# EAGLE design kitt_0805 (EAGLE 7.6.0)
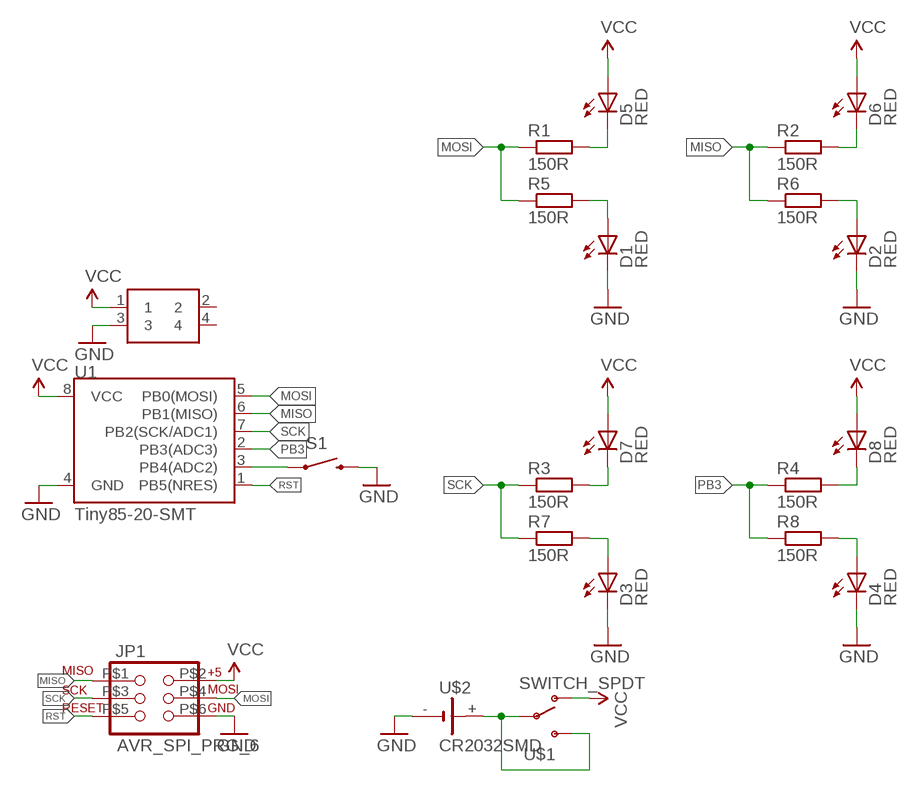
[diagram p0: schematic, sheet 1]

## Parts
D1  RED  LEDCHIP-LED0805  [CHIP-LED0805]
D2  RED  LEDCHIP-LED0805  [CHIP-LED0805]
D3  RED  LEDCHIP-LED0805  [CHIP-LED0805]
D4  RED  LEDCHIP-LED0805  [CHIP-LED0805]
D5  RED  LEDCHIP-LED0805  [CHIP-LED0805]
D6  RED  LEDCHIP-LED0805  [CHIP-LED0805]
D7  RED  LEDCHIP-LED0805  [CHIP-LED0805]
D8  RED  LEDCHIP-LED0805  [CHIP-LED0805]
JP1  AVR_SPI_PRG_6  [2X3_SMD_PAD]
R1  150R  R-EU_M0805  [M0805]
R2  150R  R-EU_M0805  [M0805]
R3  150R  R-EU_M0805  [M0805]
R4  150R  R-EU_M0805  [M0805]
R5  150R  R-EU_M0805  [M0805]
R6  150R  R-EU_M0805  [M0805]
R7  150R  R-EU_M0805  [M0805]
R8  150R  R-EU_M0805  [M0805]
S1  SWITCH-MOMENTARY-2-SMD-1101NE  [TACTILE-SWITCH-1101NE]
U1  Tiny85-20-SMT  ATTINY45TINY85-20-SMT  [SO08-EIAJ]
U$1  SWITCH_SPDT  [KPS-1290]
U$2  CR2032SMD  [CR2032SMD]
U$4  2X2-SMT  [2X2-SMT]

## Nets
GND: D1.C D2.C D3.C D4.C JP1.P$6 S1.P$2 U1.4(GND) U$2.- U$4.3
MISO: JP1.P$1 R2.1 R6.1 U1.6(PB1(MISO))
MOSI: JP1.P$4 R1.1 R5.1 U1.5(PB0(MOSI))
N$1: S1.P$1 U1.3(PB4(ADC2))
N$2: D5.C R1.2
N$3: D1.A R5.2
N$4: D3.A R7.2
N$5: U$1.P U$1.S U$2.+
N$9: D4.A R8.2
N$10: D2.A R6.2
N$11: D6.C R2.2
N$13: D7.C R3.2
N$14: D8.C R4.2
PB3: R4.1 R8.1 U1.2(PB3(ADC3))
RST: JP1.P$5 U1.1(PB5(NRES))
SCK: JP1.P$3 R3.1 R7.1 U1.7(PB2(SCK/ADC1))
VCC: D5.A D6.A D7.A D8.A JP1.P$2 U1.8(VCC) U$1.O U$4.1
Unconnected: U$4.2 U$4.4

## Library data of the parts
D1-D8 = led:LED: LED OSRAM: - CHIPLED LG R971, LG N971, LY N971, LG Q971, LY Q971, LO R971, LY R971 LH N974, LH R974 LS Q976, LO Q976, LY Q976 LO Q996 - Hyper CHIPLED LW Q18S LB Q993, LB Q99A, LB R99A - SideLED LS A670, LO A670, LY A670, LG A670, LP A670 LB A673, LV A673, LT A673, LW A673 LH A674 LY A675 LS A676, LA A676, LO A676, LY A676, LW A676 LS A679, LY A679, LG A679 - Hyper Micro SIDELED® LS Y876, LA Y876, LO Y876, LY Y876 LT Y87S - SmartLED LW L88C, LW L88S LB L89C, LB L89S, LG L890 LS L89K, LO L89K, LY L89K LS L896, LA L896, LO L896, LY L896 - TOPLED LS T670, LO T670, LY T670, LG T670, LP T670 LSG T670, LSP T670, LSY T670, LOP T670, LYG T670 LG T671, LOG T671, LSG T671 LB T673, LV T673, LT T673, LW T673 LH T674 LS T676, LA T676, LO T676, LY T676, LB T676, LH T676, LSB T676, LW T676 LB T67C, LV T67C, LT T67C, LS T67K, LO T67K, LY T67K, LW E67C LS E67B, LA E67B, LO E67B, LY E67B, LB E67C, LV E67C, LT E67C LW T67C LS T679, LY T679, LG T679 LS T770, LO T770, LY T770, LG T770, LP T770 LB T773, LV T773, LT T773, LW T773 LH T774 LS E675, LA E675, LY E675, LS T675 LS T776, LA T776, LO T776, LY T776, LB T776 LHGB T686 LT T68C, LB T68C - Hyper Mini TOPLED® LB M676 - Mini TOPLED Santana® LG M470 LS M47K, LO M47K, LY M47K Source: http://www.osram.convergy.de LUXEON: - LUMILED® LXK2-PW12-R00, LXK2-PW12-S00, LXK2-PW14-U00, LXK2-PW14-V00 LXK2-PM12-R00, LXK2-PM12-S00, LXK2-PM14-U00 LXK2-PE12-Q00, LXK2-PE12-R00, LXK2-PE12-S00, LXK2-PE14-T00, LXK2-PE14-U00 LXK2-PB12-K00, LXK2-PB12-L00, LXK2-PB12-M00, LXK2-PB14-N00, LXK2-PB14-P00, LXK2-PB14-Q00 LXK2-PR12-L00, LXK2-PR12-M00, LXK2-PR14-Q00, LXK2-PR14-R00 LXK2-PD12-Q00, LXK2-PD12-R00, LXK2-PD12-S00 LXK2-PH12-R00, LXK2-PH12-S00 LXK2-PL12-P00, LXK2-PL12-Q00, LXK2-PL12-R00 Source: www.luxeon.com KINGBRIGHT: KA-3528ASYC Source: www.kingbright.com
JP1 = SparkFun-Connectors:AVR_SPI_PRG_6: AVR ISP 6 Pin This is the reduced ISP connector for AVR programming. Common on Arduino. This footprint will take up less PCB space and can be used with a 10-pin to 6-pin adapter such as SKU: BOB-08508 **Special note about "TEST_POINT" package. The stop mask is on the top side, so if you want your programming test points to be on the bottom of your board, make sure to place this package on the bottom side of the board. This also ensure that the orientation to program from the bottom side will be correct.
R1-R8 = rcl:R-EU_: RESISTOR, European symbol
S1 = SparkFun-Electromechanical:SWITCH-MOMENTARY-2: Various NO switches- pushbuttons, reed, etc
U1 = SparkFun-DigitalIC:ATTINY45: Atmel 8-pin 2/4/8kB flash uC; PROD_ID: IC-09092
U$1 = SparkFun-Electromechanical:SWITCH_SPDT: SWCH-10651 Side-actuated SPDT slide switch, as used on the Arduino Pro; PROD_ID: SWCH-10651
U$2 = battery:CR2032SMD
U$4 = adafruit:2X2-SMT

## Board
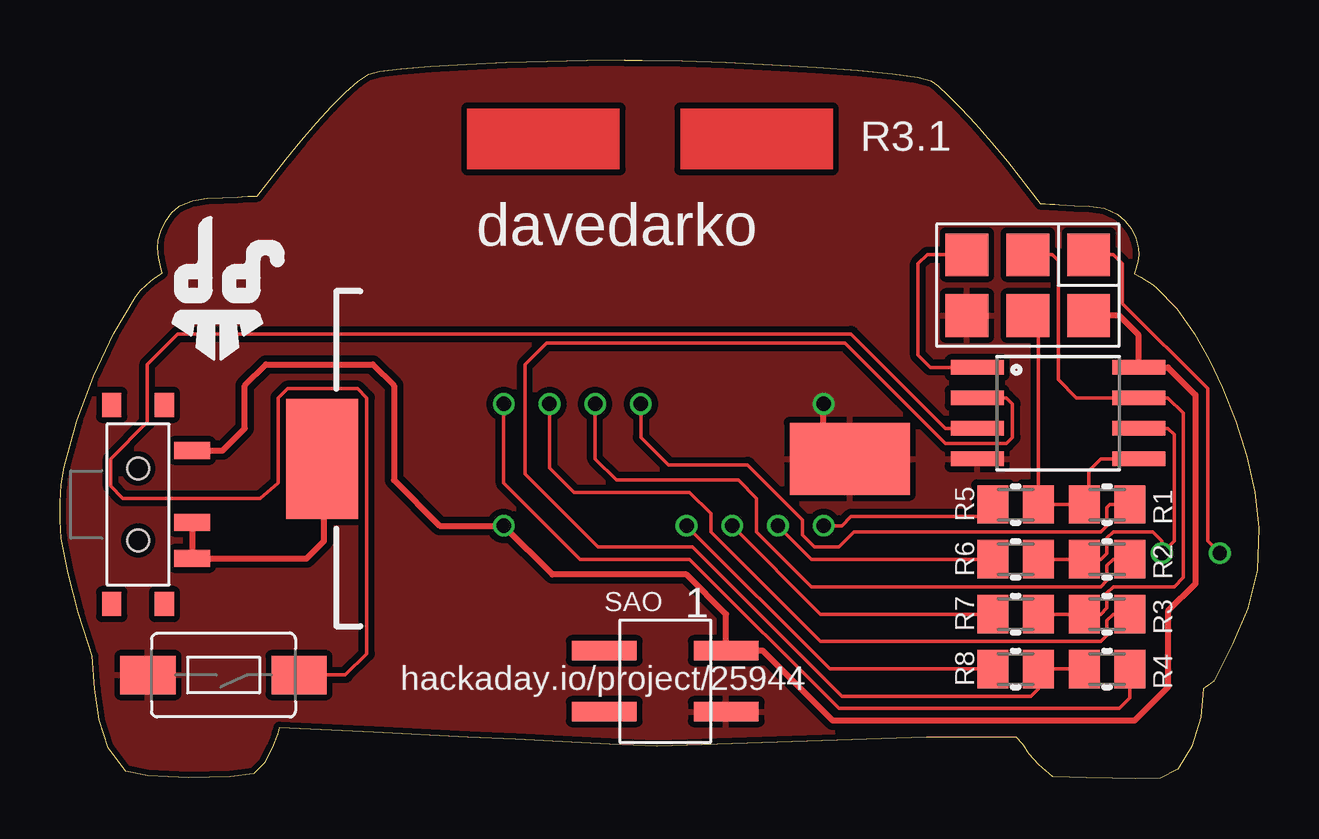
[diagram p1: board, top side]
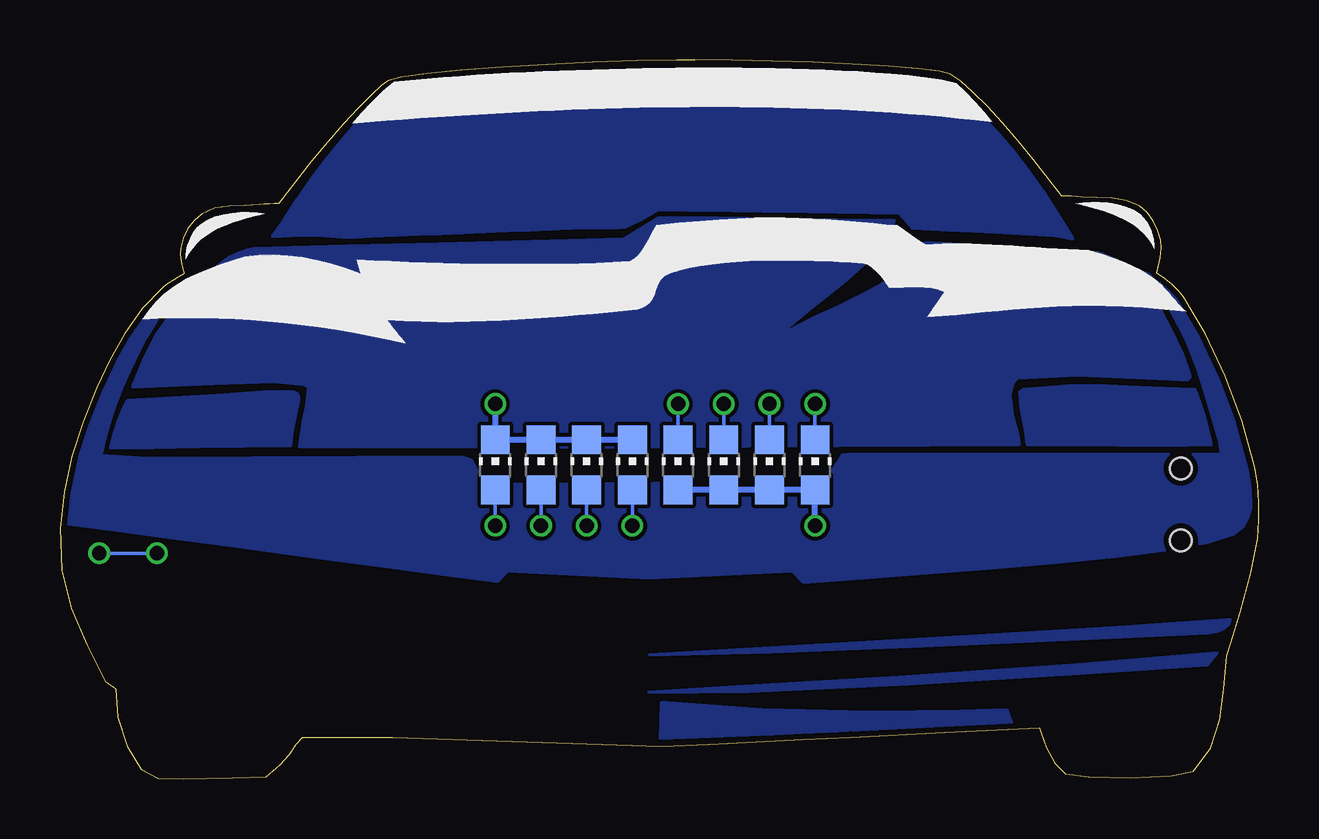
[diagram p2: board, bottom side, seen from below]

Size 49.98 x 29.96 mm. Coordinates in mm from the lower left corner, seen from the top.
Outline: 23.54,29.96 23.63,29.96 23.73,29.96 23.82,29.96 23.92,29.96 24.01,29.96 24.1,29.96 24.2,29.96 24.29,29.96 25.93,29.93 27.76,29.86 29.67,29.77 31.54,29.66 33.25,29.54 34.69,29.4 35.75,29.25 36.31,29.1 36.59,28.89 37.01,28.5 37.54,27.96 38.16,27.3 38.82,26.54 39.52,25.72 40.87,23.97 41.06,23.96 41.26,23.95 41.47,23.94 41.64,23.93 42.27,23.89 42.91,23.87 43.52,23.78 44.08,23.54 44.39,23.26 44.65,22.92 44.83,22.53 44.95,22.13 44.96,21.86 44.92,21.55 44.85,21.26 44.79,21.05 45.04,20.91 45.28,20.77 45.49,20.63 45.68,20.49 46.55,19.59 47.28,18.56 47.9,17.45 48.44,16.31 49.02,14.9 49.48,13.44 49.81,11.95 49.98,10.44 49.9,8.68 49.5,7.11 48.87,5.6 48.08,4.05 47.98,3.97 47.87,3.89 47.76,3.82 47.65,3.74 47.56,2.56 47.18,1.35 46.59,0.4 45.87,0.01 44.81,0 43.86,0.01 42.78,0.04 41.38,0.08 40.79,0.57 40.41,1.01 40.13,1.44 39.86,1.73 36.12,1.73 34.25,1.66 32.38,1.6 30.51,1.53 28.64,1.47 26.77,1.4 24.9,1.34 22.93,1.44 20.96,1.53 18.99,1.63 17.02,1.73 13.08,1.93 9.14,2.13 9.07,1.87 8.85,1.29 8.51,0.65 8.07,0.2 7.1,0.07 5.37,0.04 3.65,0.11 2.74,0.3 2.02,1.28 1.64,2.45 1.46,3.75 1.35,5.12 1.17,5.65 0.77,6.94 0.33,8.55 0.06,10.02 0,10.76 0,11.51 0.06,12.25 0.18,12.99 0.7,14.89 1.4,16.79 2.23,18.56 3.15,20.09 3.35,20.35 3.61,20.6 3.92,20.84 4.26,21.08 4.19,21.36 4.12,21.72 4.08,22.11 4.1,22.45 4.22,22.86 4.41,23.24 4.66,23.59 4.98,23.86 5.53,24.1 6.14,24.2 6.78,24.22 7.41,24.25 7.6,24.27 7.81,24.28 8.03,24.29 8.23,24.29 9.4,25.82 10.05,26.59 10.7,27.34 11.33,28.03 11.91,28.61 12.43,29.08 12.86,29.38 13.32,29.49 14.21,29.6 15.45,29.7 16.94,29.79 18.59,29.86 20.29,29.92 21.98,29.95 23.54,29.96
Outline: 23.54,29.96 23.54,29.96
Outline: 23.54,29.96 23.54,29.96
Copper layers (1*16): Top 0.035mm / dielectric 1.5mm / Bottom 0.035mm
Design rules "dirt_cheap_dirty_boards.v1.1": minimum track width 6mil, minimum drill 12mil, track to track 6mil, track to pad 6mil, pad to pad 6mil, via to via 6mil, smd to smd 0mil, copper to edge 10mil, drill to drill 10mil, minimum pad ring 10mil, minimum via ring 6mil, stop-mask expansion 2mil, vias tented up to drill 25mil, thermal gap 10mil

### Footprints (pad centres in the part's own frame; a part is rotated, then mirrored left to right if it is on the bottom)
CHIP-LED0805 = smd 1.2 x 1.2: A 0,-1.05; C 0,1.05
2X3_SMD_PAD = smd 1.778 x 1.778: P$1 -1.27,2.54; P$2 1.27,2.54; P$3 -1.27,0; P$4 1.27,0; P$5 -1.27,-2.54; P$6 1.27,-2.54
M0805 = smd 1.3 x 1.6: 1 -0.95,0; 2 0.95,0
TACTILE-SWITCH-1101NE = smd 2.3 x 1.6: P$1 -3.15,0; P$2 3.15,0
SO08-EIAJ = smd 0.61 x 2.21: 1 -1.905,-3.378; 2 -0.635,-3.378; 3 0.635,-3.378; 4 1.905,-3.378; 5 1.905,3.353; 6 0.635,3.353; 7 -0.635,3.353; 8 -1.905,3.353
KPS-1290 = smd 0.7 x 1.5: O -2.25,2.25; P 0.75,2.25; S 2.25,2.25 | smd 1 x 0.8: P$1 -4.15,1.1; P$2 -4.15,-1.1; P$3 4.15,-1.1; P$4 4.15,1.1 | hole 0.9: -1.5,0; 1.5,0
CR2032SMD = smd 5 x 3: + 0,-11 | smd 3 x 5: - 0,11
2X2-SMT = smd 0.8 x 2.7: 1 0,2.54; 2 0,-2.54; 3 2.54,2.54; 4 2.54,-2.54

### Placement (x,y rotation side)
D1  31.83,13.08 0 bottom
D2  29.93,13.08 0 bottom
D3  28.02,13.08 0 bottom
D4  26.12,13.08 0 bottom
D5  24.21,13.08 0 bottom
D6  22.31,13.08 0 bottom
D7  20.4,13.08 0 bottom
D8  18.5,13.08 0 bottom
JP1  40.34,20.57 270 top
R1  43.64,11.43 0 top
R2  43.64,9.14 0 top
R3  43.64,6.86 0 top
R4  43.64,4.57 0 top
R5  39.83,11.43 180 top
R6  39.83,9.14 180 top
R7  39.83,6.86 180 top
R8  39.83,4.57 180 top
S1  6.81,4.32 180 top
U1  41.61,15.24 270 top
U$1  3.26,11.43 270 top
U$2  21.93,13.33 270 top
U$3  [DAVEDARKO2_LOGO]  6.56,19.68 0 top
U$4  25.23,5.33 270 top

### Tracks (layer width: path | path; a pad name or v marks a point on that pad's centre or on a via)
GND  (via drill 0.6 pad 0.33)
  Top 0.254: U$2.- 31.83,14.43 v31.83,15.62
  Bottom 0.254: D4.C D3.C D2.C D1.C v31.83,15.62
  pour Top (isolate 0.254): 52.53,33.02 -0.81,33.02 -0.81,-2.54 52.53,-2.54
MISO  (via drill 0.6 pad 0.33)
  Top 0.152: R6.1 R2.1 43.39,9.14 43.64,9.4 43.64,10.03 43.9,10.29 45.55,10.29 45.93,9.91 v45.93,9.4 46.44,9.91 46.44,14.35 46.18,14.6 U1.6 | JP1.P$1 43.9,21.84 44.28,21.46 44.28,19.81 47.83,16.26 47.83,9.91 v48.34,9.4
  Bottom 0.152: v48.34,9.4 v45.93,9.4
MOSI
  Top 0.152: U1.5 43.39,13.33 42.88,12.83 42.88,11.62 R1.1 R5.1 40.78,18.86 JP1.P$4
N$1
  Top 0.152: S1.P$1 11.89,4.32 12.78,5.21 12.78,15.87 12.4,16.26 9.48,16.26 9.1,15.87 9.1,12.32 8.34,11.68 2.62,11.68 2.11,12.19 2.11,13.33 3.64,14.86 3.64,17.27 4.91,18.54 32.98,18.54 36.91,14.6 U1.3
N$2  (via drill 0.6 pad 0.33)
  Top 0.152: v24.21,15.62 24.21,14.22 25.36,13.08 28.66,13.08 30.94,10.79 30.94,10.16 31.45,9.65 32.47,9.65 33.1,10.29 43.39,10.29 43.64,10.54 43.64,11.3 43.77,11.43 R1.2
  Bottom 0.152: D5.C v24.21,15.62
N$3  (via drill 0.6 pad 0.33)
  Top 0.152: v31.83,10.54 32.59,10.54 32.98,10.92 38.38,10.92 R5.2
  Bottom 0.152: v31.83,10.54 D1.A
N$4  (via drill 0.6 pad 0.33)
  Top 0.152: R7.2 31.71,6.86 v28.02,10.54
  Bottom 0.152: v28.02,10.54 D3.A
N$5
  Top 0.254: U$2.+ 11,13.26 11,9.91 10.28,9.18 U$1.S U$1.P
N$6
  pour Bottom: 24.9,3.19 24.93,2.43 24.95,1.67 21.28,1.82 17.61,1.97 13.94,2.12 10.27,2.27 10.39,2.57 10.52,2.86 12.41,2.8 16.2,2.77 20.73,2.86
  pour Bottom: 47.16,15.77 43.42,15.98 41.25,16.14 40.24,16.12 40.08,16.03 40.03,15.82 40.15,15.22 40.3,14.52 40.36,13.89 42.27,13.86 44.17,13.84 46.08,13.81 47.86,13.79 47.75,14.31 47.56,14.89 47.31,15.46
  pour Bottom: 41.12,22.6 39.95,22.65 38.95,22.64 37.97,22.56 36.96,22.61 35.98,22.65 35.02,22.69 34.08,22.73 33.16,22.77 32.25,22.8 31.34,22.84 30.45,22.87 29.55,22.91 28.65,22.94 27.75,22.98 26.9,22.95 26.42,22.99 25.73,23.32 25.04,23.73 24.42,23.72 23.79,23.71 23.17,23.7 22.54,23.69 21.92,23.68 21.29,23.68 20.67,23.67 20.04,23.66 19.41,23.65 18.78,23.64 18.09,23.63 17.52,23.62 16.89,23.61 16.2,23.61 15.63,23.6 15,23.59 14.66,23.21 14.45,22.96 12.91,22.88 11.4,22.8 9.92,22.72 8.48,22.64 8.12,22.57 7.75,22.5 8.39,23.54 9.01,24.49 9.61,25.35 10.21,26.14 10.84,26.87 11.49,27.55 12.2,28.2 12.98,28.83 13.42,28.99 14.27,29.12 15.46,29.24 16.94,29.33 17.77,29.37 18.66,29.4 19.58,29.43 20.54,29.45 21.53,29.47 22.54,29.48 23.57,29.48 24.6,29.48 25.63,29.47 26.66,29.46 27.67,29.44 28.66,29.42 29.62,29.39 30.54,29.36 31.42,29.32 32.26,29.27 33.74,29.16 34.93,29.03 35.77,28.87 36.21,28.69 36.95,28.01 37.64,27.3 38.29,26.56 38.91,25.78 39.5,24.98 40.07,24.15 40.63,23.29
  pour Bottom: 9.81,16.23 7.98,16.36 6.34,16.38 4.51,16.29 2.68,16.22 2.47,15.67 2.29,15.1 2.12,14.5 1.99,13.94 3.94,13.89 5.89,13.91 7.83,13.92 9.65,13.94 9.76,14.68 9.92,15.52 9.97,16.12
N$7
  pour Bottom: 25.41,5.16 20.35,5.29 14,5.53 7.53,5.82 2.11,6.08 1.68,6.16 1.42,6.29 1.25,6.46 1.1,6.63 5.82,6.3 12.05,5.93 18.88,5.54
N$8
  pour Bottom: 25.46,3.6 21.27,3.64 14.59,3.96 7.51,4.38 2.15,4.75 2.05,4.87 1.95,5 1.84,5.13 1.74,5.25 7.58,4.74 15.04,4.23 21.77,3.82
N$9  (via drill 0.6 pad 0.33)
  Top 0.152: R8.2 32.09,4.57 v26.12,10.54
  Bottom 0.152: v26.12,10.54 D4.A
N$10  (via drill 0.6 pad 0.33)
  Top 0.152: R6.2 31.32,9.14 v29.93,10.54
  Bottom 0.152: v29.93,10.54 D2.A
N$11  (via drill 0.6 pad 0.33)
  Top 0.152: v22.31,15.62 22.31,13.33 23.2,12.45 28.28,12.45 29.04,11.68 29.04,10.29 31.32,8 43.39,8 43.64,8.25 43.64,8.89 43.9,9.14 R2.2
  Bottom 0.152: v22.31,15.62 D6.C
N$13  (via drill 0.6 pad 0.33)
  Top 0.152: v20.4,15.62 20.4,12.95 21.42,11.94 26.24,11.94 27.13,11.05 27.13,10.29 31.71,5.71 43.39,5.71 43.64,5.97 43.64,6.6 43.9,6.86 R3.2 44.66,7.3
  Bottom 0.152: D7.C v20.4,15.62
N$14  (via drill 0.6 pad 0.33)
  Top 0.152: R4.2 44.59,3.36 44.15,2.92 32.47,2.92 26.24,9.14 21.67,9.14 18.5,12.32 v18.5,15.62
  Bottom 0.152: v18.5,15.62 D8.C
NVRMND
  pour Bottom: 46.95,16.32 46.01,16.37 43.58,16.48 41.04,16.55 39.8,16.43 39.62,16.33 39.7,15.51 39.85,14.84 39.98,13.85 36.41,13.82 32.65,13.84 28.82,13.81 21.29,13.86 17.53,13.88 13.77,13.91 10.01,13.94 10.01,14.04 10.04,14.31 10.29,15.14 10.38,16.01 10.25,16.49 10.08,16.7 7.54,16.83 3.71,16.66 2.99,16.62 2.87,16.73 2.96,17.05 3.2,17.69 3.64,18.62 4.1,19.49 4.63,20.32 5.19,21.04 5.9,21.59 6.7,21.9 7.6,21.96 8.5,22.01 10.3,22.13 12.1,22.24 13.9,22.35 15.08,21.05 15.84,20.54 16.68,20.09 17.55,19.67 18.44,19.26 19.31,18.83 20.12,18.36 19.44,18.98 18.69,19.59 17.92,20.2 17.17,20.81 16.48,21.43 15.9,22.04 15.19,23.26 17.64,23.29 20.09,23.33 22.54,23.36 24.99,23.39 25.36,23.17 25.74,22.94 26.11,22.71 26.48,22.48 30.32,22.39 34.17,22.29 38.01,22.19 41.85,22.09 42.16,22.04 42.57,21.9 42.95,21.73 43.37,21.41 43.7,21.03 44.42,20.38 45.23,19.51 45.95,18.53 46.51,17.4
NVRMND2
  pour Bottom: 44.57,20.79 45.28,20.54 46.37,19.55 47.34,18.17 48.15,16.68 48.69,15.19 49.19,13.69 49.41,12.94 49.59,12.18 49.72,11.42 49.8,10.65 47.54,10.34 45.28,10.04 43.03,9.73 40.77,9.43 38.51,9.13 36.25,8.82 33.99,8.52 31.74,8.21 31.52,8.44 31.31,8.67 25.4,8.37 19.44,8.67 18.99,8.18 16.51,8.38 13.85,8.58 11.12,8.79 8.47,9.01 6,9.26 3.86,9.53 2.17,9.84 1.05,10.19 0.7,10.47 0.46,10.89 0.32,11.37 0.28,11.85 0.39,12.99 0.68,14.24 1.09,15.54 1.54,16.81 1.98,17.82 2.48,18.77 3.03,19.65 3.43,20.22 3.5,20.29 4,20.72 4.48,20.96 4.82,21.09 4.33,20.57 3.79,19.75 3.35,18.9 2.97,18.15 2.54,17.11 2.19,15.97 1.63,14.06 1.58,13.54 9.15,13.52 16.72,13.5 16.99,13.53 17.33,13.5 17.68,12.98 18.08,12.33 25.22,12.3 32.35,12.27 32.51,12.6 32.66,12.93 32.81,13.26 33.22,13.41 46.36,13.36 48.28,13.47 48.09,14.26 47.89,14.98 47.65,15.66 47.39,16.35 47.08,17.03 46.71,17.78 46.4,18.38 46.27,18.62 45.8,19.38 45.23,20.08 44.52,20.73
PB3
  Top 0.152: R4.1 R8.1 40.78,3.74 40.47,3.43 32.59,3.43 26.37,9.65 22.43,9.65 19.39,12.7 19.39,17.27 20.28,18.16 32.72,18.16 36.91,13.97 39.45,13.97 39.71,14.22 39.71,15.62 39.45,15.87 U1.2
RST
  Top 0.152: U1.1 36.28,17.14 35.77,17.65 35.77,21.46 36.15,21.84 JP1.P$5
SCK
  Top 0.152: R7.1 R3.1 43.39,6.86 43.64,7.11 43.64,7.75 43.9,8 46.44,8 46.82,8.38 46.82,15.24 46.18,15.87 U1.7 42.37,15.87 41.61,16.64 41.61,21.59 41.36,21.84 JP1.P$3
VCC  (via drill 0.6 pad 0.33)
  Top 0.254: U$1.O 6.78,13.68 7.7,14.6 7.7,16.38 8.59,17.27 13.04,17.27 13.93,16.38 13.93,12.45 15.83,10.54 v18.5,10.54 20.53,8.51 26.12,8.51 27.77,6.86 U$4.1 29.29,5.33 32.21,2.41 44.79,2.41 46.18,3.81 46.18,6.98 47.33,8.13 47.33,16 46.18,17.14 U1.8 44.96,18.49 44.15,19.3 JP1.P$2
  Bottom 0.254: D5.A D6.A D7.A D8.A v18.5,10.54
(copper drawn outside any net)
  shapes: Top area x2

### Text on the board
tNames: R3.1 | davedarko | SAO | hackaday.io/project/25944